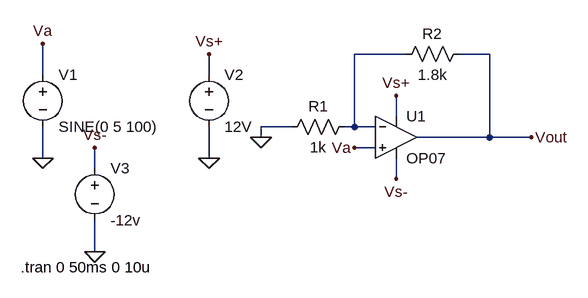
[diagram p0: schematic Non-Inverting.asc]
Non-Inverting.asc, the LTspice schematic file:
Version 4
SHEET 1 880 680
WIRE 608 48 528 48
WIRE 736 48 688 48
WIRE 48 80 48 32
WIRE 304 80 304 48
WIRE 592 144 592 112
WIRE 432 160 384 160
WIRE 528 160 528 48
WIRE 528 160 512 160
WIRE 560 160 528 160
WIRE 384 176 384 160
WIRE 736 176 736 48
WIRE 736 176 624 176
WIRE 800 176 736 176
WIRE 560 192 528 192
WIRE 48 208 48 160
WIRE 304 208 304 160
WIRE 128 224 128 192
WIRE 592 240 592 208
WIRE 128 352 128 304
FLAG 384 176 0
FLAG 128 352 0
FLAG 48 208 0
FLAG 48 32 Va
FLAG 128 192 Vs-
FLAG 528 192 Va
FLAG 592 112 Vs+
FLAG 592 240 Vs-
FLAG 304 208 0
FLAG 304 48 Vs+
FLAG 800 176 Vout
SYMBOL voltage 48 64 R0
WINDOW 123 0 0 Left 0
WINDOW 39 0 0 Left 0
SYMATTR InstName V1
SYMATTR Value SINE(0 5 100)
SYMBOL voltage 128 208 R0
WINDOW 123 0 0 Left 0
WINDOW 39 0 0 Left 0
SYMATTR InstName V3
SYMATTR Value -12v
SYMBOL OpAmps\\OP07 592 112 R0
SYMATTR InstName U1
SYMBOL res 528 144 R90
WINDOW 0 0 56 VBottom 2
WINDOW 3 32 56 VTop 2
SYMATTR InstName R1
SYMATTR Value 1k
SYMBOL res 704 32 R90
WINDOW 0 0 56 VBottom 2
WINDOW 3 32 56 VTop 2
SYMATTR InstName R2
SYMATTR Value 1.8k
SYMBOL voltage 304 64 R0
WINDOW 123 0 0 Left 0
WINDOW 39 0 0 Left 0
SYMATTR InstName V2
SYMATTR Value 12V
TEXT 14 376 Left 2 !.tran 0 50ms 0 10u

The netlist it stands for:
* Non-Inverting.asc
V1 Va 0 SINE(0 5 100)
V3 Vs- 0 -12v
XU1 Va N001 Vs+ Vs- Vout LT1001  ; OP07, pins In+ In- V+ V- OUT
R1 N001 0 1k
R2 Vout N001 1.8k
V2 Vs+ 0 12V
.tran 0 50ms 0 10u
.lib LTC.lib
.backanno
.end